# EAGLE schematic MRCS-Integrated-Turnout-Controller (EAGLE 6.5.0)
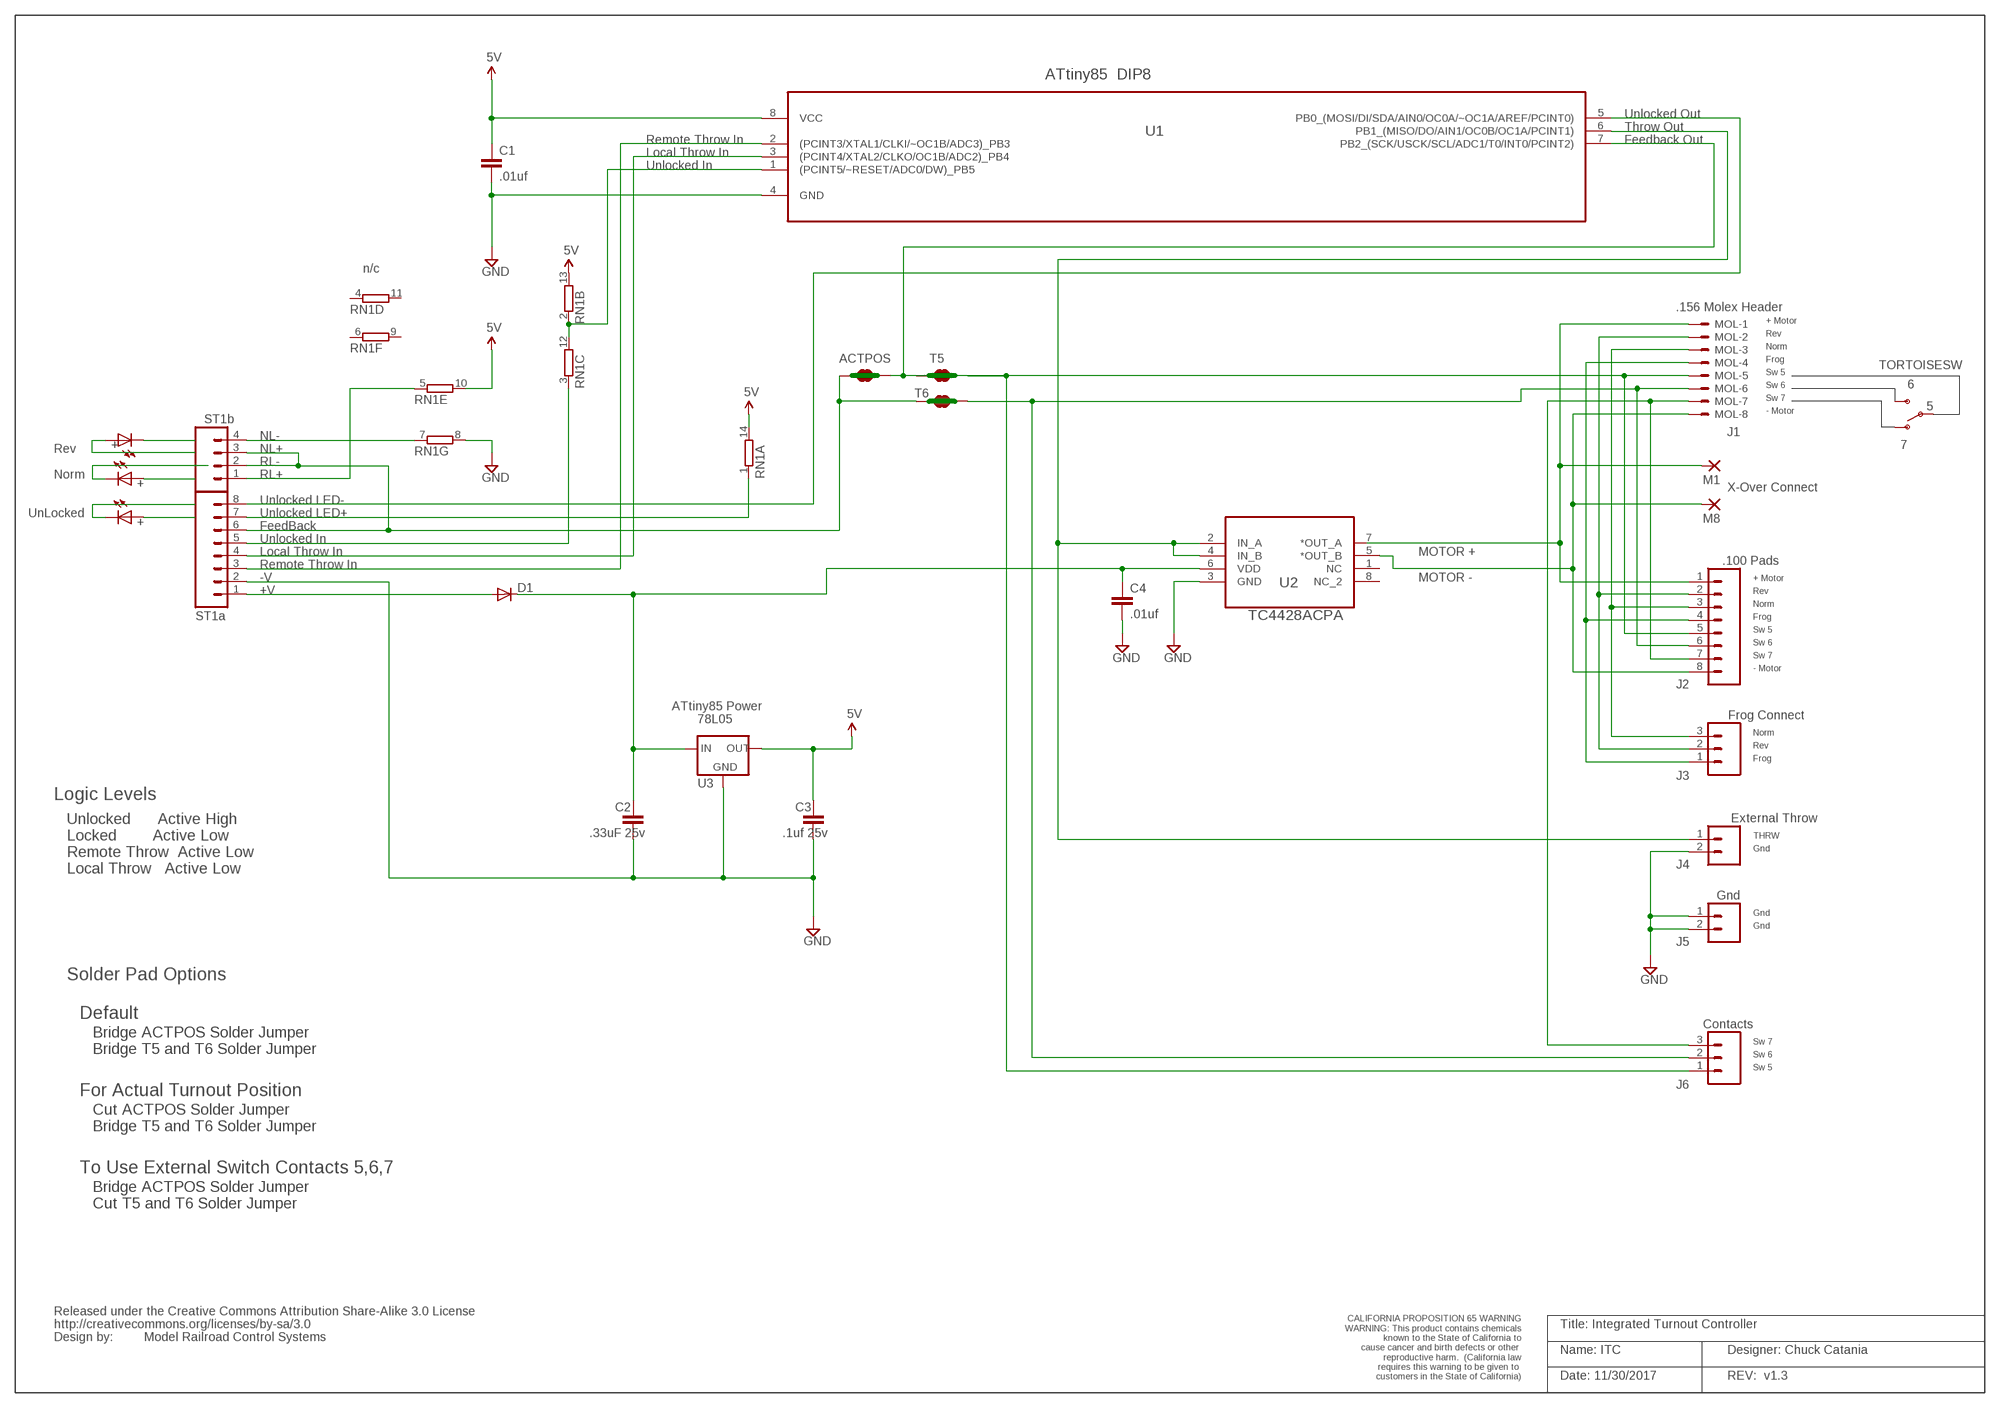
[diagram p0: schematic, sheet 1]

## Parts
ACTPOS  SOLDERJUMPERTRACE  [SJ_2S-TRACE]
C1  .01uf  22UF-6.3V-20%(0805)  [0805]
C2  .33uF 25v  CAP1210  [1210]
C3  .1uf 25v  CAP1210  [1210]
C4  .01uf  22UF-6.3V-20%(0805)  [0805]
CC_TEXT1  CREATIVE_COMMONS  [CREATIVE_COMMONS]
D1  DIODE-D-10  [D-10]
J2  M08  [1X08_PIN1_NO_SILK]
J3  M03SCREW_LOCK  [SCREWTERMINAL-3.5MM-3_LOCK.007S]
J4  M02LOCK  [1X02_LOCK]
J5  M02LOCK  [1X02_LOCK]
J6  Contacts  M03LOCK  [1X03_LOCK]
JP1  ST1a  M08LOCK  [1X08_LOCK]
JP1A  ST1b  M04LOCK  [1X04_LOCK]
LED1  LED5MM  [LED5MM]
LED2  LED5MM  [LED5MM]
LED-N  LED5MM  [LED5MM]
M1  2,54/0,8  [2,54/0,8]
M8  2,54/0,8  [2,54/0,8]
MOL  1  KK-156-8  [KK-156-8]
RN1  7R-N  [DIL14]
T5  SOLDERJUMPERTRACE  [SJ_2S-TRACE]
T6  SOLDERJUMPERTRACE  [SJ_2S-TRACE]
TORTOISESW  SWITCH_SPDT  [KPS-1290]
U1  Tiny85  ATTINY85-20PU  [DIP254P762X533-8]
U2  TC4428ACPA  [DIP254P762X432-8]
U3  78L05  V_REG_78XXTO-92_UNTESTED  [TO-92]
U$1  CA-PROP65WARNING  [CA-PROP65WARNING]

## Nets
5V: C1.1 RN1.10 RN1.13 RN1.14 U1.8(VCC)
GND: C1.2 C2.2 C3.2 C4.2 J4.2 J5.1 J5.2 JP1.2 RN1.8 U1.4(GND) U2.3(GND) U3.1(GND)
N$1: C2.1 C4.1 D1.C U2.6(VDD) U3.2(IN)
N$3: J2.6 J6.2 MOL.6 T6.2
N$4: J2.5 J6.1 MOL.5 T5.2 U1.7(PB2_(SCK/USCK/SCL/ADC1/T0/INT0/PCINT2))
N$5: J4.1 U1.6(PB1_(MISO/DO/AIN1/OC0B/OC1A/PCINT1)) U2.2(IN_A) U2.4(IN_B)
N$6: LED2.A
N$7: J2.7 J6.3 MOL.7
N$8: LED2.K(C)
N$9: JP1.3 U1.2((PCINT3/XTAL1/CLKI/~OC1B/ADC3)_PB3)
N$10: J2.1 M1.1(P) MOL.1 U2.7(*OUT_A)
N$11: J2.4 J3.1 MOL.4
N$12: JP1A.1 RN1.5
N$13: C3.1 U3.3(OUT)
N$14: JP1.4 U1.3((PCINT4/XTAL2/CLKO/OC1B/ADC2)_PB4)
N$16: JP1.8 U1.5(PB0_(MOSI/DI/SDA/AIN0/OC0A/~OC1A/AREF/PCINT0))
N$17: J2.8 M8.1(P) MOL.8 U2.5(*OUT_B)
N$18: LED-N.A
N$19: J2.2 J3.2 MOL.2
N$20: J2.3 J3.3 MOL.3
N$21: LED-N.K(C)
N$22: LED1.A
N$23: RN1.2 RN1.12 U1.1((PCINT5/~RESET/ADC0/DW)_PB5)
N$24: D1.A JP1.1
N$25: ACTPOS.1 JP1.6 JP1A.2 JP1A.3 T6.1
N$26: JP1.5 RN1.3
N$27: ACTPOS.2 T5.1
N$28: JP1.7 RN1.1
N$29: LED1.K(C)
N$30: JP1A.4 RN1.7
Unconnected: RN1.4 RN1.6 RN1.9 RN1.11 TORTOISESW.O TORTOISESW.P TORTOISESW.S U2.1(NC) U2.8(NC_2)

## Notes on the sheet
- ATtiny85  DIP8
- Unlocked Out
- Throw Out
- Remote Throw In | Feedback Out
- Local Throw In
- Unlocked In
- n/c
- .156 Molex Header
- + Motor
- Rev
- Norm
- Frog
- Sw 5
- Sw 6 | 6
- Sw 7 | 5
- - Motor
- J1
- + | NL- | 7
- Rev | NL+
- RL-
- Norm | + | RL+
- X-Over Connect
- Unlocked LED-
- UnLocked | + | Unlocked LED+
- FeedBack
- Unlocked In
- Local Throw In | MOTOR + | .100 Pads
- Remote Throw In
- -V | MOTOR - | + Motor
- +V | Rev
- Norm
- Frog
- Sw 5
- Sw 6
- Sw 7
- - Motor
- ATtiny85 Power | Frog Connect
- Norm
- Rev
- Frog
- Logic Levels
- External Throw
- THRW
- Gnd
- Unlocked      Active High
  Locked        Active Low
  Remote Throw  Active Low
  Local Throw   Active Low
- Gnd
- Gnd
- Gnd
- Solder Pad Options
- Default
- Sw 7
- Sw 6
- Bridge ACTPOS Solder Jumper
  Bridge T5 and T6 Solder Jumper
- Sw 5
- For Actual Turnout Position
- Cut ACTPOS Solder Jumper
  Bridge T5 and T6 Solder Jumper
- To Use External Switch Contacts 5,6,7
- Bridge ACTPOS Solder Jumper
  Cut T5 and T6 Solder Jumper
- Title: Integrated Turnout Controller
- Model Railroad Control Systems
- Name: ITC | Designer: Chuck Catania
- Date: 11/30/2017 | REV:  v1.3

## Library data of the parts
ACTPOS T5 T6 = SparkFun-Passives:SOLDERJUMPER: Solder Jumper Standard SMD solder jumper. Used to automate production. Two varients : Normally Open and Normally Closed are the same, but have different paste layers. NC will have a large amount of paste and should jumper during reflow.
C1 C4 = SparkFun-Capacitors:22UF-6.3V-20%(0805): Ceramic CAP-08402; PROD_ID: CAP-08402; VALUE: 22uF
C2 C3 = SparkFun-Passives:CAP: Capacitor Standard 0603 ceramic capacitor, and 0.1" leaded capacitor.
CC_TEXT1 = SparkFun-Aesthetics:CREATIVE_COMMONS: Creative Commons License summary
D1 = diode:DIODE-: DIODE
J2 JP1 = SparkFun-Connectors:M08: Header 8 Standard 8-pin 0.1" header. Use with straight break away headers (SKU : PRT-00116), right angle break away headers (PRT-00553), swiss pins (PRT-00743), machine pins (PRT-00117), and female headers (PRT-00115).
J3 J6 = SparkFun-Connectors:M03: Header 3 Standard 3-pin 0.1" header. Use with straight break away headers (SKU : PRT-00116), right angle break away headers (PRT-00553), swiss pins (PRT-00743), machine pins (PRT-00117), and female headers (PRT-00115). Molex polarized connector foot print use with SKU : PRT-08232 with associated crimp pins and housings.
J4 J5 = SparkFun-Connectors:M02: Standard 2-pin 0.1" header. Use with - straight break away headers ( PRT-00116) - right angle break away headers (PRT-00553) - swiss pins (PRT-00743) - machine pins (PRT-00117) - female headers (PRT-00115) Molex polarized connector foot print use with: PRT-08233 with associated crimp pins and housings. 2.54_SCREWTERM for use with PRT-10571. 3.5mm Screw Terminal footprints for PRT-08084 5mm Screw Terminal footprints for use with PRT-08433
JP1A = SparkFun-Connectors:M04: Header 4 Standard 4-pin 0.1" header. Use with straight break away headers (SKU : PRT-00116), right angle break away headers (PRT-00553), swiss pins (PRT-00743), machine pins (PRT-00117), and female headers (PRT-00115). Molex polarized connector foot print use with SKU : PRT-08231 with associated crimp pins and housings. 1MM SMD Version SKU: PRT-10208
LED1 LED2 LED-N = SparkFun-LED:LED: LEDs Standard schematic elements and footprints for 5mm, 3mm, 1206, and 0603 sized LEDs. 5mm - Spark Fun Electronics SKU : COM-00529 (and others)
M1 M8 = wirepad:2,54/0,8: THROUGH-HOLE PAD
MOL = con-molex:KK-156-8: KK 156 HEADER Source: http://www.molex.com/pdm_docs/sd/026604100_sd.pdf; OC_FARNELL: unknown; OC_NEWARK: unknown
RN1 = resistor-dil:7R-N: DIL RESISTOR; OC_FARNELL: unknown; OC_NEWARK: unknown
TORTOISESW = SparkFun-Electromechanical:SWITCH_SPDT: Side-actuated SPDT slide switch, as used on the Arduino Pro
U1 = Atmel_By_element14_Batch_1-00:ATTINY85-20PU: 8-bit Microcontroller with In-System Programmable Flash; MPN: ATTINY85-20PU; OC_FARNELL: 1455162; OC_NEWARK: 58M3796; PACKAGE: PDIP-8; SUPPLIER: Atmel
U2 = Microchip_By_element14_Batch_1:TC4428ACPA: IC, DRIVER, MOSFET, DUAL 1.5A; MPN: TC4428ACPA; OC_FARNELL: 1332313; OC_NEWARK: 34M8782; PACKAGE: DIP8; SUPPLIER: Microchip
U3 = SparkFun-PowerIC:V_REG_78XX: Voltage Regulator Standard 7805 5V regulator. IGO (Input Ground Output). Spark Fun Electronics SKU : COM-00107
U$1 = MRCS-prop65warningBtm:CA-PROP65WARNING: CALIFORNIA PROPOSITION 65 WARNING